# EAGLE design CH340BRIDGE CONVERTER (EAGLE 9.6.2)
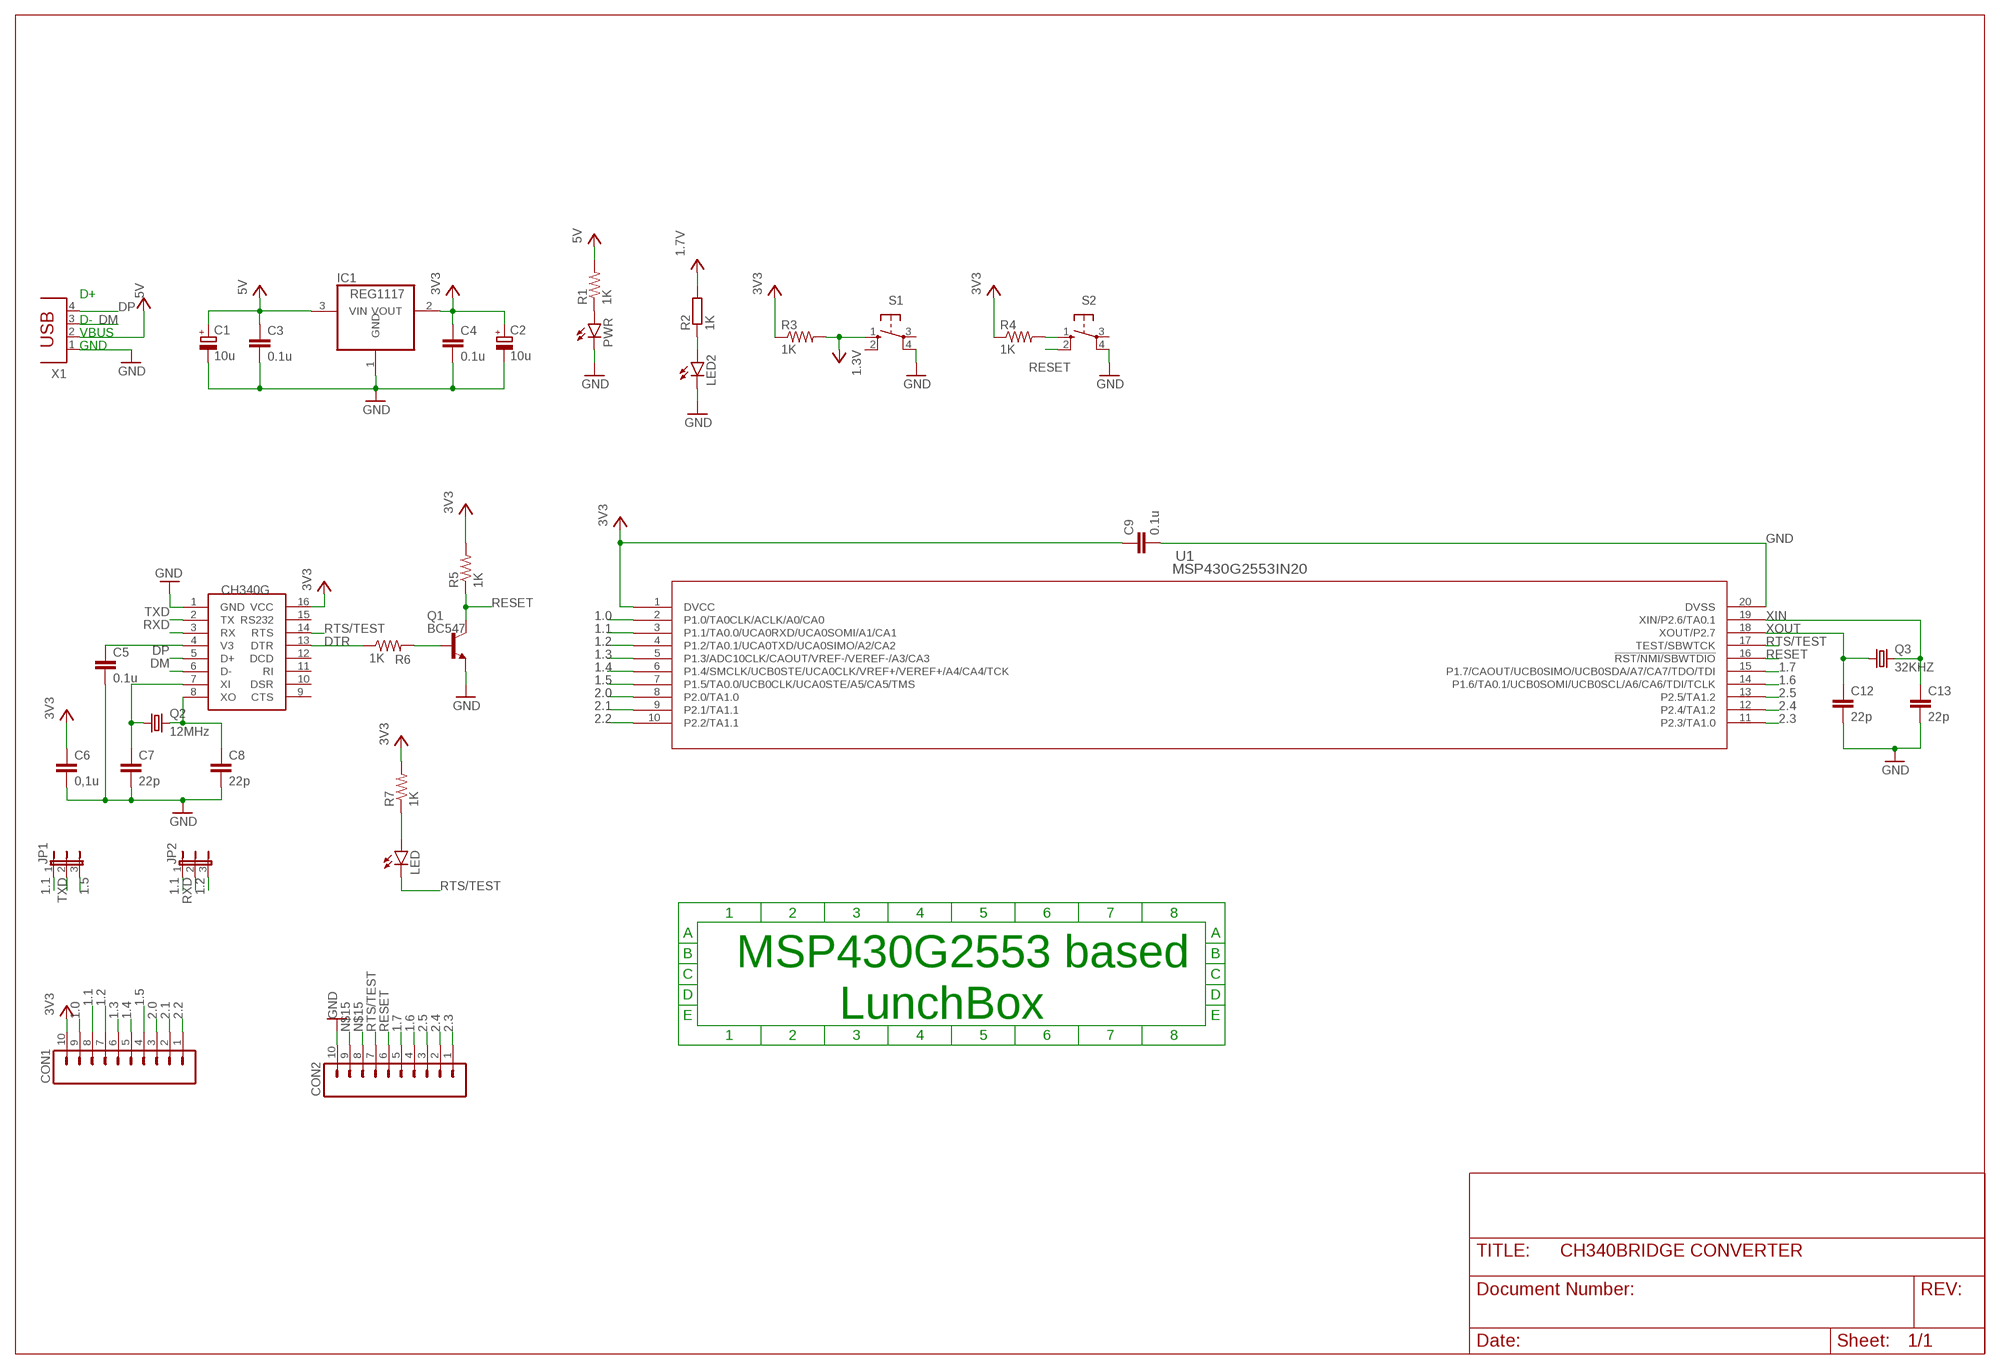
[diagram p0: schematic, sheet 1]

## Parts
C1  10u  CPOL-EUTT5D7  [TT5D7]
C2  10u  CPOL-EUTT5D7  [TT5D7]
C3  0.1u  C-EU025-025X050  [C025-025X050]
C4  0.1u  C-EU025-025X050  [C025-025X050]
C5  0.1u  C-EUC0805  [C0805]
C6  0,1u  C-EUC0805  [C0805]
C7  22p  C-EUC0805  [C0805]
C8  22p  C-EUC0805  [C0805]
C9  0.1u  C-EU075-032X103  [C075-032X103]
C12  22p  C-EUC0805  [C0805]
C13  22p  C-EUC0805  [C0805]
CON1  M10  [10P]
CON2  M10  [10P]
IC1  REG1117  [SOT223]
JP1  JP2E  [JP2]
JP2  JP2E  [JP2]
LED  LED3MM  [LED3MM]
LED2  LED3MM  [LED3MM]
PWR  LED3MM  [LED3MM]
Q1  BC547  [TO92]
Q2  12MHz  CRYSTALHC49S  [HC49/S]
Q3  32KHZ  CRYSTALTC26H  [TC26H]
R1  1K  R-US_0207/10  [0207/10]
R2  1K  R-EU_0207/12  [0207/12]
R3  1K  R-US_0204/7  [0204/7]
R4  1K  R-US_0204/7  [0204/7]
R5  1K  R-US_0207/10  [0207/10]
R6  1K  R-US_0207/10  [0207/10]
R7  1K  R-US_0207/10  [0207/10]
S1  10-XX  [B3F-10XX]
S2  10-XX  [B3F-10XX]
U1  MSP430G2553IN20  [N20_TEX]
U$1  CH340G  [SOIC16]
X1  PN87520  [PN87520]

## Nets
1.0: CON1.9 U1.2(P1.0/TA0CLK/ACLK/A0/CA0)
1.1: CON1.8 JP1.1 JP2.1 U1.3(P1.1/TA0.0/UCA0RXD/UCA0SOMI/A1/CA1)
1.2: CON1.7 JP2.3 U1.4(P1.2/TA0.1/UCA0TXD/UCA0SIMO/A2/CA2)
1.3: CON1.6 U1.5(P1.3/ADC10CLK/CAOUT/VREF-/VEREF-/A3/CA3)
1.4: CON1.5 U1.6(P1.4/SMCLK/UCB0STE/UCA0CLK/VREF+/VEREF+/A4/CA4/TCK)
1.5: CON1.4 JP1.3 U1.7(P1.5/TA0.0/UCB0CLK/UCA0STE/A5/CA5/TMS)
1.6: CON2.4 U1.14(P1.6/TA0.1/UCB0SOMI/UCB0SCL/A6/CA6/TDI/TCLK)
1.7: CON2.5 U1.15(P1.7/CAOUT/UCB0SIMO/UCB0SDA/A7/CA7/TDO/TDI)
2.0: CON1.3 U1.8(P2.0/TA1.0)
2.1: CON1.2 U1.9(P2.1/TA1.1)
2.2: CON1.1 U1.10(P2.2/TA1.1)
2.3: CON2.1 U1.11(P2.3/TA1.0)
2.4: CON2.2 U1.12(P2.4/TA1.2)
2.5: CON2.3 U1.13(P2.5/TA1.2)
DM: U$1.6(D-) X1.3
DP: U$1.5(D+) X1.4
DTR: R6.1 U$1.13(DTR)
GND: C1.- C2.- C3.2 C4.2 C5.2 C6.2 C7.2 C8.2 C9.2 C12.2 C13.2 CON2.10 IC1.1(GND) LED2.K(C) PWR.K(C) Q1.1(E) S1.4(P1) S2.4(P1) U1.20(DVSS) U$1.1(GND) X1.1
N$1: PWR.A R1.1
N$2: LED2.A R2.1
N$3: R4.2 S2.1(S)
N$6: C5.1 U$1.4(V3)
N$8: C7.1 Q2.1 U$1.7(XI)
N$9: C8.1 Q2.2 U$1.8(XO)
N$11: Q1.2(B) R6.2
N$14: LED.A R7.1
N$15: CON2.8 CON2.9
RESET: CON2.6 Q1.3(C) R5.1 S2.2(S1) U1.16(!RST/NMI/SBWTDIO)
RTS/TEST: CON2.7 LED.K(C) U1.17(TEST/SBWTCK) U$1.14(RTS)
RXD: JP2.2 U$1.3(RX)
TXD: JP1.2 U$1.2(TX)
VCC: C1.+ C2.+ C3.1 C4.1 C6.1 C9.1 CON1.10 IC1.2(VOUT) IC1.3(VIN) R1.2 R2.2 R3.1 R3.2 R4.1 R5.2 R7.2 S1.1(S) U1.1(DVCC) U$1.16(VCC) X1.2 ; supply symbol labelled 5V, 1.7V, 3V3, 1.3V
XIN: C13.1 Q3.2 U1.19(XIN/P2.6/TA0.1)
XOUT: C12.1 Q3.1 U1.18(XOUT/P2.7)
Unconnected: S1.2(S1) S1.3(P) S2.3(P) U$1.9(CTS) U$1.10(DSR) U$1.11(RI) U$1.12(DCD) U$1.15(RS232)

## Notes on the sheet
- D+
- D-
- VBUS
- GND
- MSP430G2553 based
- LunchBox

## Library data of the parts
C1 C2 = rcl:CPOL-EU: POLARIZED CAPACITOR, European symbol; SPICEPREFIX: C
C3-C9 C12 C13 = rcl:C-EU: CAPACITOR, European symbol; SPICEPREFIX: C
CON1 = con-amp-quick:M10: AMP QUICK CONNECTOR; OC_FARNELL: unknown; OC_NEWARK: unknown; SPICEPREFIX: C
CON2 = con-amp-quick:M10: AMP QUICK CONNECTOR; OC_FARNELL: unknown; OC_NEWARK: unknown
IC1 = burr-brown:REG1117: 800mA and 1A Low Dropout (LDO) Positive Regulator 1.8V, 2.5V, 2.85V, 3.3V, 5V, and Adj; MPN: REG1117; OC_FARNELL: 1097566; OC_NEWARK: 14P6981
JP1 JP2 = jumper:JP2E: JUMPER
LED LED2 PWR = led:LED: LED OSRAM: - CHIPLED LG R971, LG N971, LY N971, LG Q971, LY Q971, LO R971, LY R971 LH N974, LH R974 LS Q976, LO Q976, LY Q976 LO Q996 - Hyper CHIPLED LW Q18S LB Q993, LB Q99A, LB R99A - SideLED LS A670, LO A670, LY A670, LG A670, LP A670 LB A673, LV A673, LT A673, LW A673 LH A674 LY A675 LS A676, LA A676, LO A676, LY A676, LW A676 LS A679, LY A679, LG A679 - Hyper Micro SIDELED® LS Y876, LA Y876, LO Y876, LY Y876 LT Y87S - SmartLED LW L88C, LW L88S LB L89C, LB L89S, LG L890 LS L89K, LO L89K, LY L89K LS L896, LA L896, LO L896, LY L896 - TOPLED LS T670, LO T670, LY T670, LG T670, LP T670 LSG T670, LSP T670, LSY T670, LOP T670, LYG T670 LG T671, LOG T671, LSG T671 LB T673, LV T673, LT T673, LW T673 LH T674 LS T676, LA T676, LO T676, LY T676, LB T676, LH T676, LSB T676, LW T676 LB T67C, LV T67C, LT T67C, LS T67K, LO T67K, LY T67K, LW E67C LS E67B, LA E67B, LO E67B, LY E67B, LB E67C, LV E67C, LT E67C LW T67C LS T679, LY T679, LG T679 LS T770, LO T770, LY T770, LG T770, LP T770 LB T773, LV T773, LT T773, LW T773 LH T774 LS E675, LA E675, LY E675, LS T675 LS T776, LA T776, LO T776, LY T776, LB T776 LHGB T686 LT T68C, LB T68C - Hyper Mini TOPLED® LB M676 - Mini TOPLED Santana® LG M470 LS M47K, LO M47K, LY M47K Source: http://www.osram.convergy.de LUXEON: - LUMILED® LXK2-PW12-R00, LXK2-PW12-S00, LXK2-PW14-U00, LXK2-PW14-V00 LXK2-PM12-R00, LXK2-PM12-S00, LXK2-PM14-U00 LXK2-PE12-Q00, LXK2-PE12-R00, LXK2-PE12-S00, LXK2-PE14-T00, LXK2-PE14-U00 LXK2-PB12-K00, LXK2-PB12-L00, LXK2-PB12-M00, LXK2-PB14-N00, LXK2-PB14-P00, LXK2-PB14-Q00 LXK2-PR12-L00, LXK2-PR12-M00, LXK2-PR14-Q00, LXK2-PR14-R00 LXK2-PD12-Q00, LXK2-PD12-R00, LXK2-PD12-S00 LXK2-PH12-R00, LXK2-PH12-S00 LXK2-PL12-P00, LXK2-PL12-Q00, LXK2-PL12-R00 Source: www.luxeon.com KINGBRIGHT: KA-3528ASYC Source: www.kingbright.com
Q1 = transistor-npn:BC547*: NPN Transistor
Q2 = crystal:CRYSTAL: CRYSTAL; OC_FARNELL: 1667008; OC_NEWARK: unknown
Q3 = crystal:CRYSTAL: CRYSTAL; OC_FARNELL: unknown; OC_NEWARK: unknown
R1 R3-R7 = rcl:R-US_: RESISTOR, American symbol; SPICEPREFIX: R
R2 = rcl:R-EU_: RESISTOR, European symbol; SPICEPREFIX: R
S1 S2 = switch-omron:10-XX: OMRON SWITCH; MPN: B3F-1000; OC_FARNELL: 176432; OC_NEWARK: 36M3542
U1 = MSP430G2553IN20:MSP430G2553IN20; COPYRIGHT: Copyright (C) 2024 Ultra Librarian. All rights reserved.; MANUFACTURER_PART_NUMBER: MSP430G2553IN20; MFR_NAME: Texas Instruments
U$1 = ch340g:CH340G
X1 = con-berg:PN87520: BERG USB connector; OC_FARNELL: unknown; OC_NEWARK: unknown

## Board
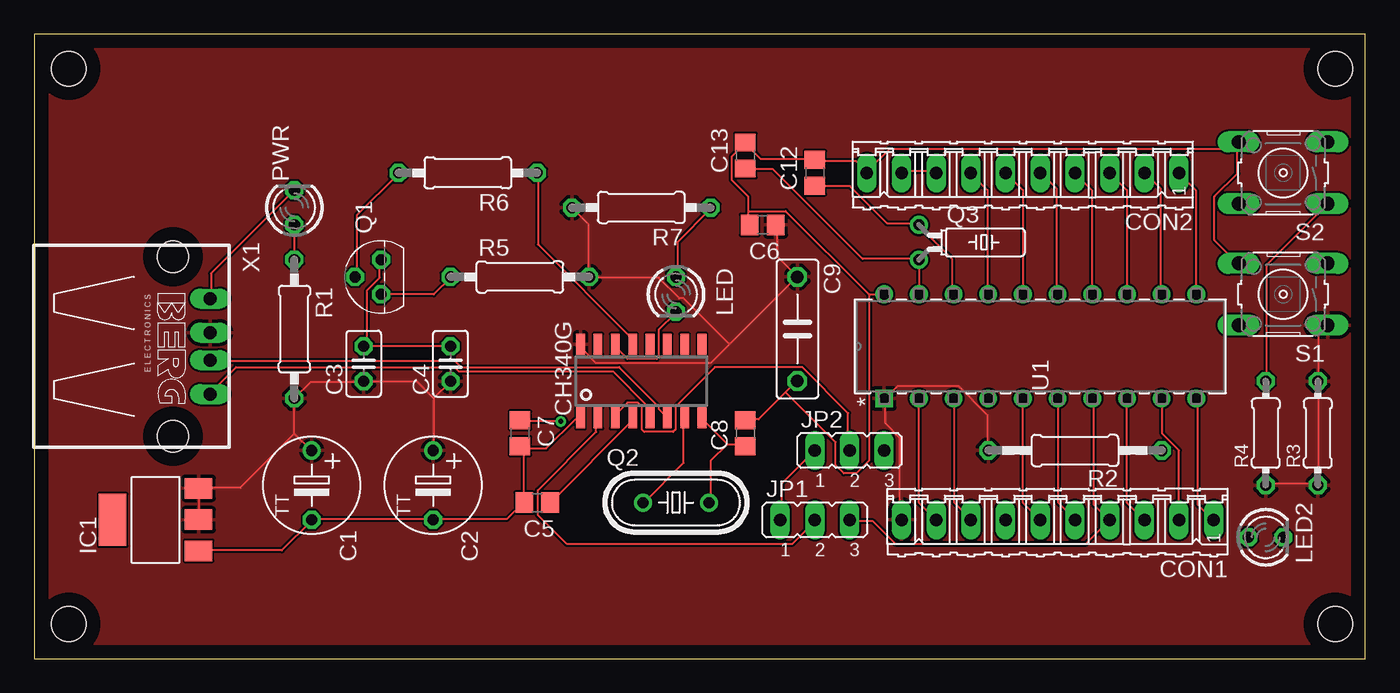
[diagram p1: board, top side]
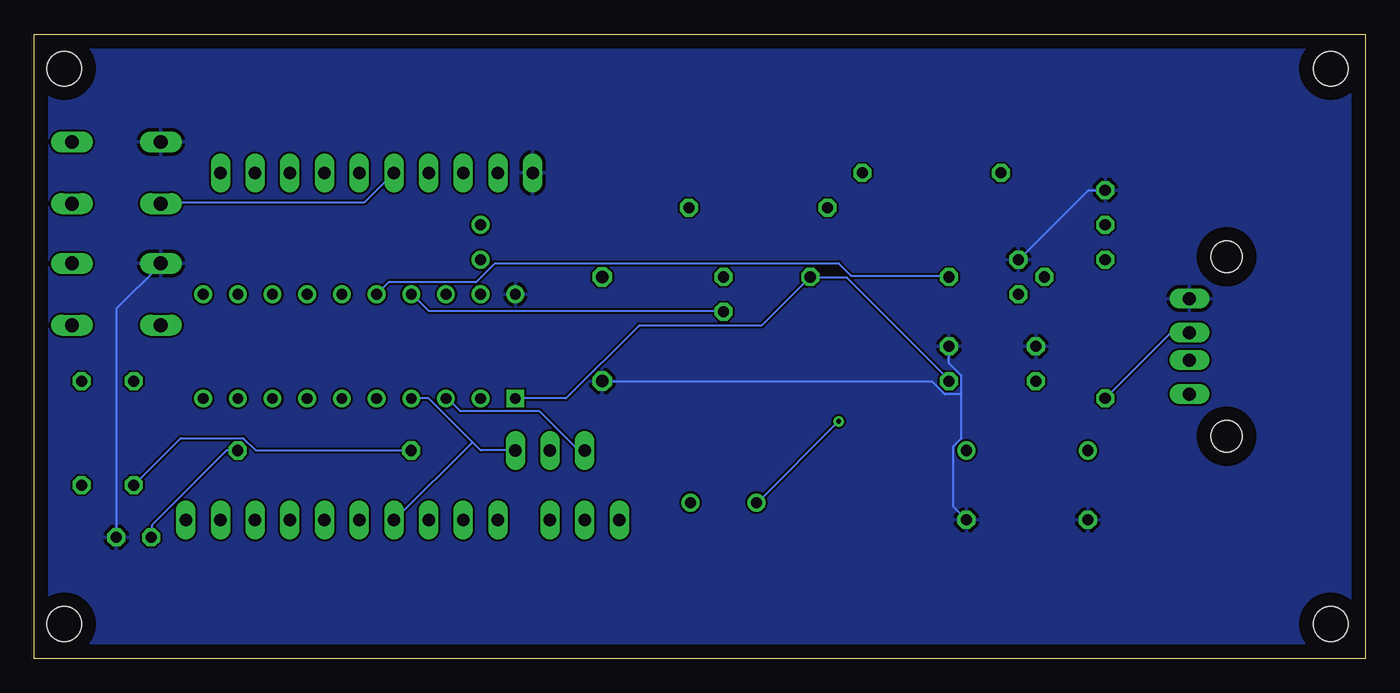
[diagram p2: board, bottom side, seen from below]

Size 97.46 x 45.71 mm. Coordinates in mm from the lower left corner, seen from the top.
Outline: 0,0 97.46,0 97.46,45.71 0,45.71 0,0
Copper layers (1*16): Top 0.035mm / dielectric 1.5mm / Bottom 0.035mm
Design rules "default": minimum track width 6mil, minimum drill 0.35mm, track to track 6mil, track to pad 6mil, pad to pad 6mil, via to via 6mil, smd to smd 6mil, copper to edge 40mil, drill to drill 6mil, minimum pad ring 10mil, minimum via ring 8mil, stop-mask expansion 4mil, vias tented up to drill 0mil, thermal gap 10mil
Holes 2.54 mm at 2.54,43.18 2.54,2.54 95.25,2.54 95.25,43.18

### Footprints (pad centres in the part's own frame; a part is rotated, then mirrored left to right if it is on the bottom)
TT5D7 = drill 0.813: + -2.54,0 | drill 0.813 octagon: - 2.54,0
C025-025X050 = drill 0.813 octagon: 1 -1.27,0; 2 1.27,0
C0805 = smd 1.3 x 1.5: 1 -0.95,0; 2 0.95,0
C075-032X103 = drill 0.914 octagon: 1 -3.81,0; 2 3.81,0
10P = drill 0.914 long: 1 -11.43,0; 2 -8.89,0; 3 -6.35,0; 4 -3.81,0; 5 -1.27,0; 6 1.27,0; 7 3.81,0; 8 6.35,0; 9 8.89,0; 10 11.43,0
SOT223 = smd 1.499 x 2.007: 1 -2.261,-3.15; 2 0.025,-3.15; 3 2.311,-3.15 | smd 3.81 x 2.007: 4 0,3.15
JP2 = drill 0.914 long: 1 -2.54,0; 2 0,0; 3 2.54,0
LED3MM = drill 0.813 octagon: A -1.27,0; K 1.27,0
TO92 = drill 0.813 octagon: 1 1.27,0; 2 0,1.905; 3 -1.27,0
HC49/S = drill 0.813: 1 -2.413,0; 2 2.413,0
TC26H = drill 0.813: 1 -1.27,0; 2 1.27,0
0207/10 = drill 0.813 octagon: 1 -5.08,0; 2 5.08,0
0207/12 = drill 0.813 octagon: 1 -6.35,0; 2 6.35,0
0204/7 = drill 0.813 octagon: 1 -3.81,0; 2 3.81,0
B3F-10XX = drill 1.016 long: 1 -3.251,2.261; 2 3.251,2.261; 3 -3.251,-2.261; 4 3.251,-2.261
N20_TEX = drill 0.787 pad 1.295 square: 1 0,0 | drill 0.787 pad 1.295: 2 0,-2.54; 3 0,-5.08; 4 0,-7.62; 5 0,-10.16; 6 0,-12.7; 7 0,-15.24; 8 0,-17.78; 9 0,-20.32; 10 0,-22.86; 11 7.62,-22.86; 12 7.62,-20.32; 13 7.62,-17.78; 14 7.62,-15.24; 15 7.62,-12.7; 16 7.62,-10.16; 17 7.62,-7.62; 18 7.62,-5.08; 19 7.62,-2.54; 20 7.62,0
SOIC16 = smd 0.635 x 1.524: 1 -4.445,-2.695; 2 -3.175,-2.695; 3 -1.905,-2.695; 4 -0.635,-2.695; 5 0.635,-2.695; 6 1.905,-2.695; 7 3.175,-2.695; 8 4.445,-2.695; 9 4.445,2.695; 10 3.175,2.695; 11 1.905,2.695; 12 0.635,2.695; 13 -0.635,2.695; 14 -1.905,2.695; 15 -3.175,2.695; 16 -4.445,2.695
PN87520 = drill 0.95 long: 1 -3.5,2.71; 2 -1,2.71; 3 1,2.71; 4 3.5,2.71 | hole 2.3: -6.57,0; 6.57,0

### Placement (x,y rotation side)
C1  20.32,12.7 270 top
C2  29.21,12.7 270 top
C3  24.13,21.59 90 top
C4  30.48,21.59 90 top
C5  36.83,11.43 180 top
C6  53.34,31.75 180 top
C7  35.56,16.51 270 top
C8  52.07,16.51 90 top
C9  55.88,24.13 270 top
C12  57.15,35.56 90 top
C13  52.07,36.83 90 top
CON1  74.93,10.16 180 top
CON2  72.39,35.56 180 top
IC1  8.89,10.16 90 top
JP1  57.15,10.16 0 top
JP2  59.69,15.24 0 top
LED  46.99,26.67 270 top
LED2  90.17,8.89 0 top
PWR  19.05,33.02 90 top
Q1  25.4,27.94 90 top
Q2  46.99,11.43 0 top
Q3  64.77,30.48 270 top
R1  19.05,24.13 270 top
R2  76.2,15.24 180 top
R3  93.98,16.51 90 top
R4  90.17,16.51 90 top
R5  35.56,27.94 0 top
R6  31.75,35.56 180 top
R7  44.45,33.02 180 top
S1  91.44,26.67 180 top
S2  91.44,35.56 180 top
U1  62.23,19.05 90 top
U$1  44.45,20.32 0 top
X1  10.16,22.86 270 top

### Tracks (layer width: path | path; a pad name or v marks a point on that pad's centre or on a via)
1.0
  Top 0.152: U1.2 64.77,11.43 CON1.9
1.1
  Top 0.152: JP2.1 54.71,12.8 54.71,10.21 JP1.1 | U1.3 67.36,19.05 67.36,11.43 68.58,10.21 CON1.8
  Bottom 0.152: JP2.1 57.61,15.24 60.5,18.14 66.29,18.14 67.21,19.05 U1.3
1.2
  Bottom 0.152: U1.4 68.58,19.05 65.38,15.85 | 65.38,15.85 64.77,15.24 JP2.3 | 65.38,15.85 71.02,10.21 CON1.7
1.3
  Top 0.152: U1.5 72.39,11.43 CON1.6
1.4
  Top 0.152: U1.6 74.98,19.05 74.98,11.43 76.2,10.21 CON1.5
1.5
  Top 0.152: U1.7 77.57,19.05 77.57,11.28 78.64,10.21 CON1.4 76.96,8.38 63.09,8.38 61.42,10.06 59.74,10.06 JP1.3
1.6
  Top 0.152: U1.14 77.42,26.67 77.42,34.29 76.2,35.51 CON2.4
1.7
  Top 0.152: U1.15 74.83,26.67 74.83,34.44 73.76,35.51 CON2.5
2.0
  Top 0.152: U1.8 80.01,11.43 CON1.3
2.1
  Top 0.152: CON1.2 83.82,15.24 82.6,16.46 82.6,19.05 U1.9
2.2
  Top 0.152: U1.10 85.19,19.05 85.19,11.28 86.26,10.21 CON1.1
2.3
  Top 0.152: U1.11 85.04,26.67 85.04,34.29 83.82,35.51 CON2.1
2.4
  Top 0.152: U1.12 82.45,26.67 82.45,34.44 81.38,35.51 CON2.2
2.5
  Top 0.152: U1.13 80.01,34.29 CON2.3
DM
  Top 0.152: U$1.6 46.33,17.68 45.72,18.29 45.72,18.44 42.82,21.34 31.24,21.34 30.79,21.79 12.95,21.79 X1.3
DP
  Top 0.152: U$1.5 44.96,17.68 44.96,18.44 42.37,21.03 31.09,21.03 30.79,21.34 14.78,21.34 12.95,19.51 X1.4
DTR
  Top 0.152: U$1.13 43.74,23.17 43.74,23.47 36.88,30.33 36.88,35.51 R6.1
GND
  Top 0.152: 88.09,37.34 88.09,35.51 86.41,33.83 86.41,30.63 88.09,28.96 S1.4 | 88.09,37.34 88.09,37.8 S2.4 88.09,37.34 | 55.02,19.51 55.78,20.27 C9.2 | 55.02,19.51 53.03,17.53 52.12,17.53 C8.2 | 60.96,35.66 60.2,36.42 57.15,36.42 C12.2 57.15,36.58 53.19,36.58 52.12,37.64 C13.2 51.97,37.64 51.05,36.73 51.05,35.05 52.27,33.83 52.27,32.77 | 52.27,32.77 52.27,31.85 C6.2 | 61.11,26.67 U1.20 | 61.11,26.67 55.02,32.77 52.27,32.77 | 55.02,19.51 58.67,15.85 58.67,14.17 59.28,13.56 60.2,13.56 61.11,14.48 61.11,26.67 | C4.2 24.38,22.86 | 24.38,22.86 C3.2 24.23,22.86 | 24.38,22.86 24.38,26.97 25.3,27.89 25.3,29.11 Q1.1 | PWR.K 12.95,28.19 12.95,26.36 X1.1 | IC1.1 12.04,7.93 18.14,7.93 20.27,10.06 C1.- 20.42,10.21 29.11,10.21 C2.- 29.26,10.21 34.59,10.21 35.81,11.43 | 35.81,15.39 35.81,11.43 | 35.81,15.39 35.66,15.54 C7.2 35.81,15.39 | 35.81,15.39 37.49,15.39 39.62,17.53 39.93,17.53 U$1.1 | 35.81,11.43 C5.2 | 88.09,37.34 62.64,37.34 60.96,35.66 | 60.96,35.66 CON2.10
  Bottom 0.152: LED2.K 91.44,25.6 88.24,28.8 S1.4 | PWR.K 20.27,34.29 25.3,29.26 Q1.1 | C4.2 30.48,21.64 29.57,20.73 29.57,19.36 | 29.57,19.36 29.57,16.15 30.18,15.54 30.18,11.12 C2.- | 29.57,19.36 30.79,19.36 31.7,20.27 55.78,20.27 C9.2
  pour Bottom: 0,45.72 97.79,45.72 97.79,0 0,0
N$1
  Top 0.152: PWR.A R1.1
N$2
  Bottom 0.152: R2.1 83.36,15.24 88.85,9.75 88.85,8.99 LED2.A
N$3
  Top 0.152: R4.2 90.22,20.42 90.22,28.8 94.64,33.22 S2.1
N$6
  Top 0.152: C5.1 37.8,11.43 43.89,17.53 U$1.4
N$8  (via drill 0.35)
  Top 0.152: v38.56,17.37 35.66,17.37 C7.1 | U$1.7 47.55,17.53 47.55,14.33 44.65,11.43 Q2.1
  Bottom 0.152: v38.56,17.37 44.5,11.43 Q2.1
N$9
  Top 0.152: 50.75,15.7 51.97,15.7 C8.1 | 50.75,15.7 48.92,17.53 U$1.8 | 50.75,15.7 49.53,14.48 49.53,11.43 Q2.2
N$11
  Top 0.152: Q1.2 23.62,28.04 23.62,32.46 26.67,35.51 R6.2
N$14
  Top 0.152: LED.A 47.09,28.04 47.09,30.48 49.53,32.92 R7.1
N$15
  Top 0.152: CON2.9 63.55,35.66 65.99,35.66 CON2.8
RESET
  Top 0.152: Q1.3 29.26,26.67 30.48,27.89 R5.1 | U1.16 72.39,34.29 CON2.6
  Bottom 0.152: CON2.6 73.3,33.38 88.09,33.38 S2.2 | U1.16 71.48,27.58 65.08,27.58 63.7,28.96 38.56,28.96 37.64,28.04 30.48,28.04 R5.1
RTS/TEST
  Top 0.152: U$1.14 42.67,23.01 42.67,22.71 43.43,21.95 45.57,21.95 45.72,22.1 45.72,24.08 46.94,25.3 LED.K | U1.17 69.8,26.67 69.8,34.29 68.58,35.51 CON2.7
  Bottom 0.152: LED.K 47.09,25.45 68.58,25.45 69.8,26.67 U1.17
RXD
  Top 0.152: U$1.3 42.67,17.68 42.67,17.98 43.43,18.75 44.2,18.75 44.5,18.44 44.5,16.76 44.65,16.61 46.79,16.61 46.94,16.76 46.94,18.44 49.84,21.34 56.24,21.34 59.59,17.98 59.59,15.24 JP2.2
TXD
  Top 0.152: U$1.2 41.15,17.53 41.15,16.61 36.88,12.34 36.88,10.52 39.01,8.38 55.47,8.38 57.15,10.06 JP1.2
VCC
  Top 0.152: 62.33,19.05 62.33,17.22 63.4,16.15 63.4,10.21 CON1.10 | 62.33,19.05 63.25,19.96 67.67,19.96 69.8,17.83 69.8,15.24 R2.2 | 62.33,19.05 U1.1 | R4.1 90.22,12.8 93.88,12.8 R3.1 94.03,12.8 94.03,20.27 R3.2 94.03,20.42 94.03,23.77 94.64,24.38 S1.1 | R7.2 40.54,31.85 40.54,28.04 R5.2 40.69,27.89 45.72,27.89 47.24,26.36 47.55,26.36 50.9,23.01 | C6.1 54.41,31.7 54.41,29.41 C9.1 55.78,27.89 50.9,23.01 | 50.9,23.01 49.53,21.64 41.15,21.64 40.08,22.71 40.08,23.01 U$1.16 | 29.26,19.05 29.26,15.24 C2.+ | 29.26,19.05 30.48,20.27 C4.1 | 29.26,19.05 28.04,20.27 24.23,20.27 C3.1 24.08,20.27 20.27,20.27 R1.2 19.05,16.46 | IC1.2 IC1.3 12.04,12.5 15.09,12.5 19.05,16.46 | 19.05,16.46 20.27,15.24 C1.+
  Bottom 0.152: R2.2 81.23,15.24 82.14,16.15 86.72,16.15 R4.1 | R1.2 14.33,23.77 12.95,23.77 X1.2 | C4.1 30.48,20.42 37.95,27.89 40.54,27.89 R5.2 44.2,24.38 53.19,24.38 58.52,19.05 U1.1
  pour Top: 0,45.72 97.79,45.72 97.79,0 0,0
XIN
  Top 0.152: C13.1 52.12,35.81 54.1,35.81 60.66,29.26 64.77,29.26 Q3.2 U1.19
XOUT
  Top 0.152: C12.1 57.15,34.59 59.74,34.59 62.48,31.85 64.77,31.85 Q3.1 64.77,31.7 67.21,29.26 67.21,26.67 U1.18

### Text on the board
tValues: MSP430 Lunch Box | Avinash